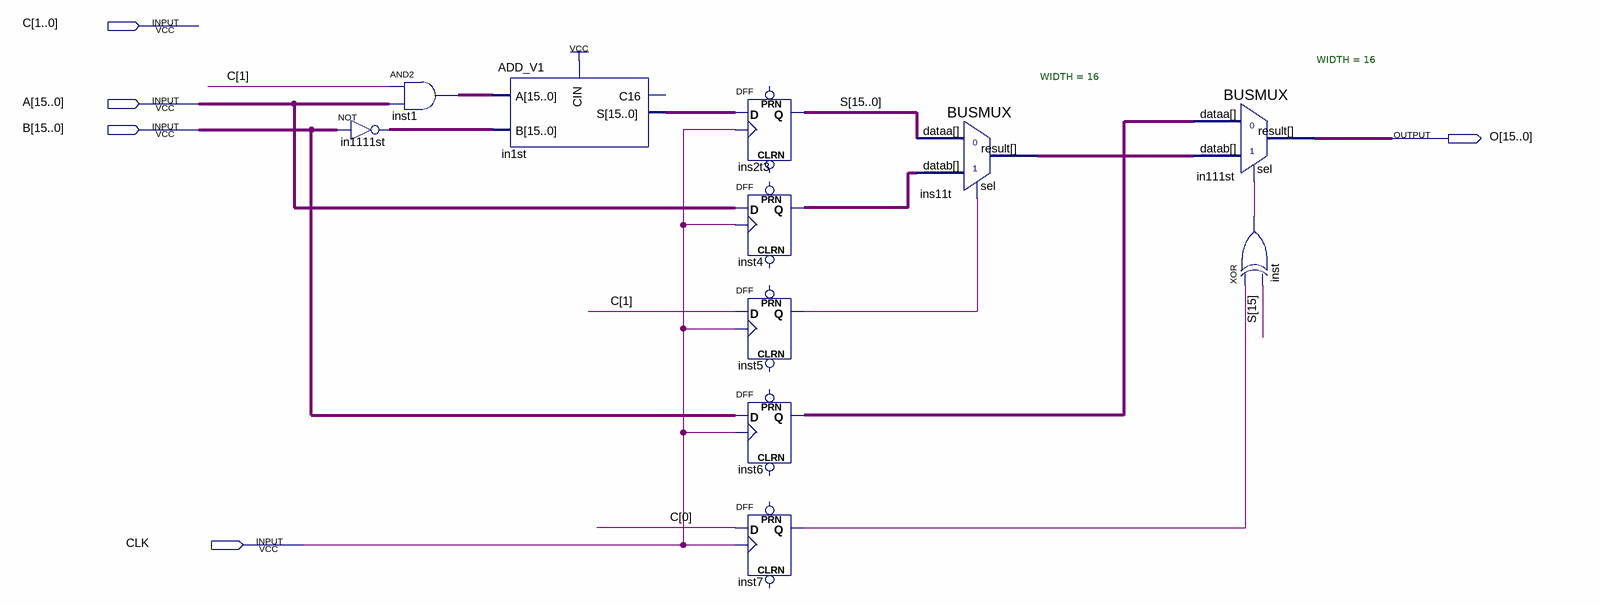
[diagram p0: schematic sheet]
// Quartus schematic ABSMINMAX.bdf as structural Verilog: 11 symbols, 5 pins
module ABSMINMAX (
  input  [1:0] C,
  input  [15:0] A,
  input  [15:0] B,
  input  CLK,
  output [15:0] O
);

  wire inst5_q, inst7_q, inst_out;
  wire [15:0] in1st_s, in1111st_out, ins11t_result, inst1_out, inst4_q, inst6_q, S;

  assign inst1_out = {16{C[1]}} & A;  // AND2 inst1, 16 bits wide
  assign in1111st_out = ~B;  // NOT in1111st, 16 bits wide
  ADD_V1 in1st (.A(inst1_out), .B(in1111st_out), .CIN(1'b1), .S(in1st_s));  // open: C16
  DFF ins2t3[15:0] (.CLK(CLK), .D(in1st_s), .Q(S));  // open: CLRN, PRN
  DFF inst4[15:0] (.CLK(CLK), .D(A), .Q(inst4_q));  // open: CLRN, PRN
  DFF inst5 (.CLK(CLK), .D(C[1]), .Q(inst5_q));  // open: CLRN, PRN
  DFF inst6[15:0] (.CLK(CLK), .D(B), .Q(inst6_q));  // open: CLRN, PRN
  DFF inst7 (.CLK(CLK), .D(C[0]), .Q(inst7_q));  // open: CLRN, PRN
  BUSMUX #(.WIDTH(16)) ins11t (.datab(inst4_q), .sel(inst5_q), .dataa(S), .result(ins11t_result));
  BUSMUX #(.WIDTH(16)) in111st (.datab(ins11t_result), .sel(inst_out), .dataa(inst6_q), .result(O));
  xor inst (inst_out, inst7_q, S[15]);
endmodule
